# EAGLE design TwoStep (EAGLE 6.2)
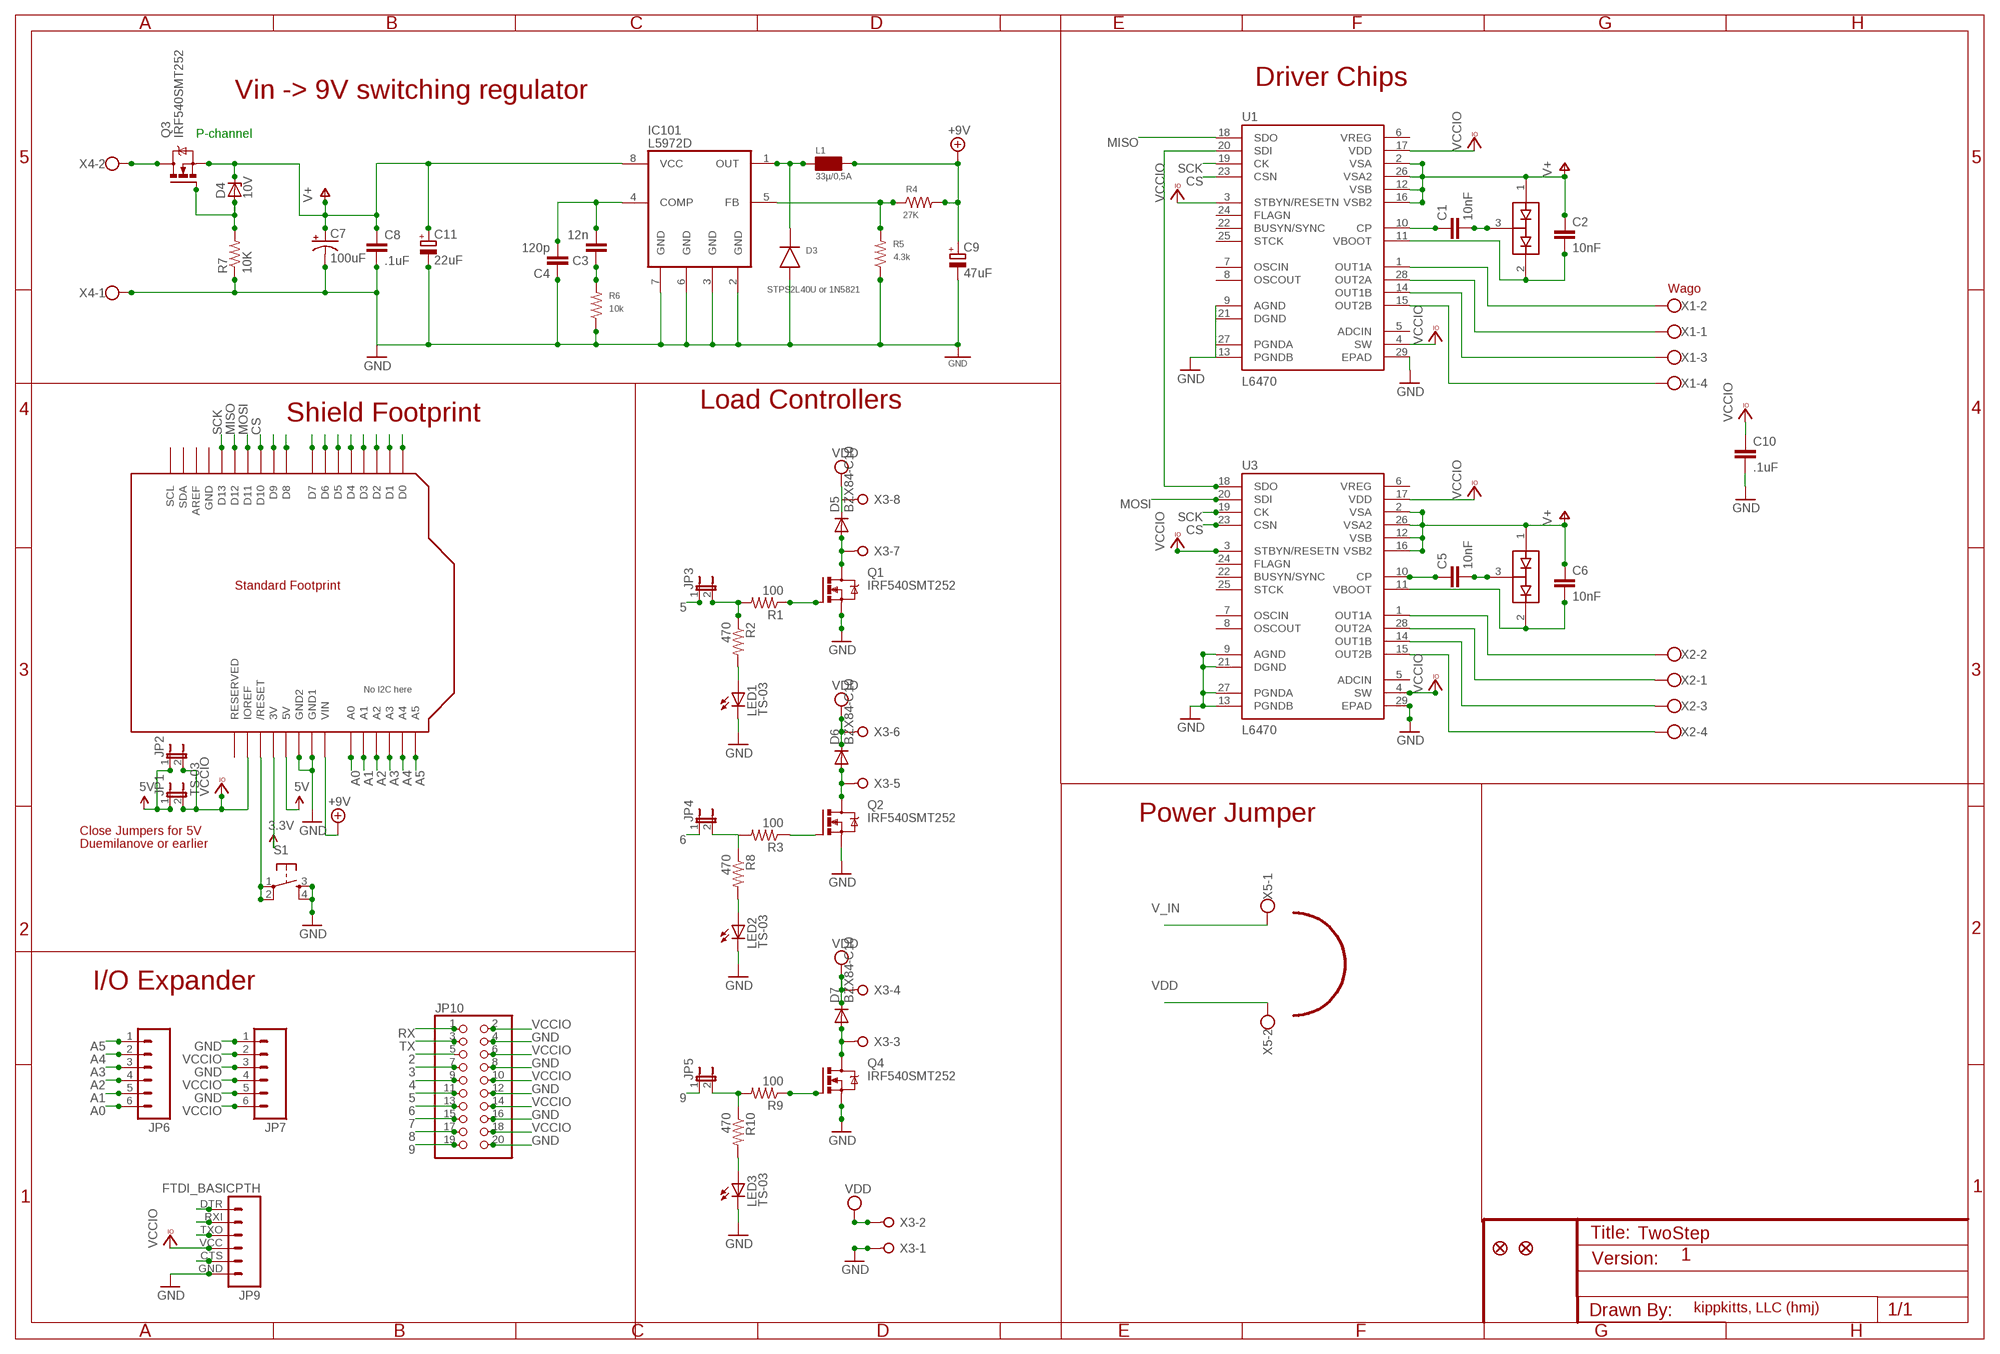
[diagram p0: schematic, sheet 1]

## Parts
C1  10nF  CAP0603-CAP  [0603-CAP]
C2  10nF  CAP0603-CAP  [0603-CAP]
C3  12n  CAP0603-CAP  [0603-CAP]
C4  120p  CAP0603-CAP  [0603-CAP]
C5  10nF  CAP0603-CAP  [0603-CAP]
C6  10nF  CAP0603-CAP  [0603-CAP]
C7  100uF  CAP_POLF80  [NIPPON_F80]
C8  .1uF  CAP0603-CAP  [0603-CAP]
C9  47uF  CPOL-EUC  [PANASONIC_C]
C10  .1uF  CAP0603-CAP  [0603-CAP]
C11  22uF  CPOL-EUC  [PANASONIC_C]
D1  BAV99  MISCELLANY_BAV99  [MISCELLANY_SOT23]
D2  BAV99  MISCELLANY_BAV99  [MISCELLANY_SOT23]
D3  STPS2L40U or 1N5821  DIODE-SMB  [DO-214AA(SMB)]
D4  10V  ZENER-DIODESOT23  [SOT23]
D5  BZX84-C10  DIODESMA-ALT  [SMA-DIODE_ALT]
D6  BZX84-C10  DIODESMA-ALT  [SMA-DIODE_ALT]
D7  BZX84-C10  DIODESMA-ALT  [SMA-DIODE_ALT]
IC101  L5972D  [SO-8]
JP1  TS-03  JUMPER-2PTH  [1X02]
JP2  JUMPER-2SMD-NO  [SJ_2S-NO]
JP3  JUMPER-2SMD-NC  [SJ_2S]
JP4  JUMPER-2SMD-NC  [SJ_2S]
JP5  JUMPER-2SMD-NC  [SJ_2S]
JP6  M06SIP  [1X06]
JP7  M06SIP  [1X06]
JP8  FIDUCIAL1X2  [FIDUCIAL-1X2]
JP9  FTDI_BASICPTH  [FTDI_BASIC]
JP10  PINHD-2X10HAND  [2X10HAND]
JP11  FIDUCIAL1X2  [FIDUCIAL-1X2]
L1  33µ/0,5A  DROSSEL-S  [WE-PD-S]
LED1  TS-03  LEDCHIP-LED0603  [CHIP-LED0603]
LED2  TS-03  LEDCHIP-LED0603  [CHIP-LED0603]
LED3  TS-03  LEDCHIP-LED0603  [CHIP-LED0603]
Q1  IRF540SMT252  [D-PAK_TO252AA]
Q2  IRF540SMT252  [D-PAK_TO252AA]
Q3  IRF540SMT252  [D-PAK_TO252AA]
Q4  IRF540SMT252  [D-PAK_TO252AA]
R1  100  RESISTOR0603-RES  [0603-RES]
R2  470  RESISTOR0603-RES  [0603-RES]
R3  100  RESISTOR0603-RES  [0603-RES]
R4  27K  RESISTOR0603-RES  [0603-RES]
R5  4.3k  RESISTOR0603-RES  [0603-RES]
R6  10k  RESISTOR0603-RES  [0603-RES]
R7  10K  RESISTOR0603-RES  [0603-RES]
R8  470  RESISTOR0603-RES  [0603-RES]
R9  100  RESISTOR0603-RES  [0603-RES]
R10  470  RESISTOR0603-RES  [0603-RES]
S1  TAC_SWITCHSMD  [TACTILE_SWITCH_SMD]
U1  L6470  MISCELLANY_L6470  [MISCELLANY_HTSSOP28]
U2  ARDUINOR3-BPLACE  [ARDUINOR3-BPLACE]
U3  L6470  MISCELLANY_L6470  [MISCELLANY_HTSSOP28]
X1  W237-4  [W237-4]
X2  W237-4  [W237-4]
X3  W237-08P  [W237-8P]
X4  W237-102  [W237-102]
X5  W237-102  [W237-102]

## Nets
1_OUT1A: U1.1(OUT1A) X1.2
1_OUT1B: U1.14(OUT1B) X1.3
1_OUT2A: U1.28(OUT2A) X1.1
1_OUT2B: U1.15(OUT2B) X1.4
2: JP10.5 U2.D2
2_OUT1A: U3.1(OUT1A) X2.2
2_OUT1B: U3.14(OUT1B) X2.3
2_OUT2A: U3.28(OUT2A) X2.1
2_OUT2B: U3.15(OUT2B) X2.4
3: JP10.7 U2.D3
3.3V: U2.3V
4: JP10.9 U2.D4
5: JP3.1 JP10.11 U2.D5
5V: JP1.1 JP2.1 U2.5V
6: JP4.1 JP10.13 U2.D6
7: JP10.15 U2.D7
8: JP10.17 U2.D8
9: JP5.1 JP10.19 U2.D9
+9V: C9.+ L1.2 R4.2 U2.VIN
A0: JP6.6 U2.A0
A1: JP6.5 U2.A1
A2: JP6.4 U2.A2
A3: JP6.3 U2.A3
A4: JP6.2 U2.A4
A5: JP6.1 U2.A5
CS: U1.23(CSN) U2.D10 U3.23(CSN)
CTS: JP9.CTS
DTR: JP9.DTR
GND: C4.1 C7.- C8.2 C9.- C10.2 C11.- D3.A IC101.2(GND) IC101.3(GND) IC101.6(GND) IC101.7(GND) JP7.1 JP7.3 JP7.5 JP9.GND JP10.4 JP10.8 JP10.12 JP10.16 JP10.20 LED1.C LED2.C LED3.C Q1.3(S) Q2.3(S) Q4.3(S) R5.1 R6.1 R7.1 S1.3 S1.4 U1.9(AGND) U1.13(PGNDB) U1.21(DGND) U1.27(PGNDA) U1.29(EPAD) U2.GND1 U2.GND2 U3.9(AGND) U3.13(PGNDB) U3.21(DGND) U3.27(PGNDA) U3.29(EPAD) X3.1 X4.1
MISO: U1.18(SDO) U2.D12
MOSI: U2.D11 U3.20(SDI)
N$1: Q1.1(G) R1.1
N$3: JP3.2 R1.2 R2.1
N$4: Q2.1(G) R3.1
N$5: LED1.A R2.2
N$6: D4.1(A) Q3.1(G) R7.2
N$7: LED2.A R8.2
N$9: C1.1 U1.10(CP)
N$10: C1.2 D1.3(COM)
N$11: C2.2 D1.2(C2) U1.11(VBOOT)
N$12: U1.20(SDI) U3.18(SDO)
N$13: JP4.2 R3.2 R8.1
N$14: Q4.1(G) R9.1
N$15: LED3.A R10.2
N$16: C5.1 U3.10(CP)
N$17: C5.2 D2.3(COM)
N$18: C6.2 D2.2(C2) U3.11(VBOOT)
N$20: JP5.2 R9.2 R10.1
N$21: D5.A Q1.4(D) X3.7
N$23: S1.1 S1.2 U2.RESET(/RESET)
N$25: D6.A Q2.4(D) X3.5
N$27: D7.A Q4.4(D) X3.3
N$50: D3.C(K) IC101.1(OUT) L1.1
N$51: IC101.5(FB) R4.1 R5.2
N$55: C3.2 C4.2 IC101.4(COMP)
N$60: C3.1 R6.2
RX: JP9.RXI JP10.1 U2.D0
SCK: U1.19(CK) U2.D13 U3.19(CK)
TX: JP9.TXO JP10.3 U2.D1
V+: C2.1 C6.1 C7.+ C8.1 C11.+ D1.1(A1) D2.1(A1) D4.3(C) IC101.8(VCC) Q3.3(S) U1.2(VSA) U1.12(VSB) U1.16(VSB2) U1.26(VSA2) U3.2(VSA) U3.12(VSB) U3.16(VSB2) U3.26(VSA2)
V_IN: Q3.4(D) X4.2 X5.1
VCCIO: C10.1 JP1.2 JP2.2 JP7.2 JP7.4 JP7.6 JP9.VCC JP10.2 JP10.6 JP10.10 JP10.14 JP10.18 U1.3(STBYN/RESETN) U1.4(SW) U1.17(VDD) U2.IOREF U3.3(STBYN/RESETN) U3.4(SW) U3.17(VDD)
VDD: D5.C D6.C D7.C X3.2 X3.4 X3.6 X3.8 X5.2
Unconnected: U1.5(ADCIN) U1.6(VREG) U1.7(OSCIN) U1.8(OSCOUT) U1.22(BUSYN/SYNC) U1.24(FLAGN) U1.25(STCK) U2.AREF U2.RESERVED U2.SCL U2.SDA U3.5(ADCIN) U3.6(VREG) U3.7(OSCIN) U3.8(OSCOUT) U3.22(BUSYN/SYNC) U3.24(FLAGN) U3.25(STCK)

## Notes on the sheet
- Driver Chips
- Vin -> 9V switching regulator
- P-channel
- Wago
- Load Controllers
- Shield Footprint
- Power Jumper
- Close Jumpers for 5V
- Duemilanove or earlier
- I/O Expander
- 1
- kippkitts, LLC (hmj)

## Power pins joined to a net without a drawn wire
GND: U2.GND

## Library data of the parts
C1-C6 C8 C10 = KippKitts:CAP: Capacitor Standard 0603 ceramic capacitor, and 0.1" leaded capacitor.
C7 = KippKitts:CAP_POL: Capacitor Polarized These are standard SMD and PTH capacitors. Normally 10uF, 47uF, and 100uF in electrolytic and tantalum varieties. Always verify the external diameter of the through hole cap, it varies with capacity, voltage, and manufacturer. The EIA devices should be standard.
C9 C11 = rcl:CPOL-EU: POLARIZED CAPACITOR, European symbol
D1 D2 = KippKitts:MISCELLANY_BAV99: BAV99 Two small signal silicon diodes connected anode to cathode. Connections to all three nodes available.
D3 = Arm9-Discrete:DIODE
D4 = diode:ZENER-DIODE: Z-Diode
D5-D7 = SparkFun:DIODE: Diode These are standard reverse protection diodes and small signal diodes. SMA package can handle up to about 1A. SOD-323 can handle about 200mA. What the SOD-323 package when ordering, there are some mfgs out there that are 5-pin packages.
IC101 = ARM9-IC:L5972: 2 A Switch Step Down Regulator
JP1-JP5 = SparkFun:JUMPER-2: Jumper Basic 0.1" spaced jumper. Use with breakaway headers.
JP6 JP7 = SparkFun:M06: Header 6 Standard 6-pin 0.1" header. Use with straight break away headers (SKU : PRT-00116), right angle break away headers (PRT-00553), swiss pins (PRT-00743), machine pins (PRT-00117), and female headers (PRT-00115). Molex polarized connector foot print use with SKU : PRT-08094 with associated crimp pins and housings. NOTES ON THE VARIANTS LOCK and LOCK_LONGPADS... This footprint was designed to help hold the alignment of a through-hole component (i.e. 6-pin header) while soldering it into place. You may notice that each hole has been shifted either up or down by 0.005 of an inch from it's more standard position (which is a perfectly straight line). This slight alteration caused the pins (the squares in the middle) to touch the edges of the holes. Because they are alternating, it causes a "brace" to hold the component in place. 0.005 has proven to be the perfect amount of "off-center" position when using our standard breakaway headers. Although looks a little odd when you look at the bare footprint, once you have a header in there, the alteration is very hard to notice. Also, if you push a header all the way into place, it is covered up entirely on the bottom side. This idea of altering the position of holes to aid alignment will be further integrated into the Sparkfun Library for other footprints. It can help hold any component with 3 or more connection pins.
JP8 JP11 = SparkFun:FIDUCIAL: Fiducial Alignment Points Various fiducial points for machine vision alignment.
JP9 = SparkFun:FTDI_BASIC: FTDI Basic: 3.3V and 5V
JP10 = KippKitts:PINHD-2X10: PIN HEADER
L1 = Arm9-Discrete:DROSSEL
LED1-LED3 = Tabber:LED: LED OSRAM: - CHIPLED LG R971, LG N971, LY N971, LG Q971, LY Q971, LO R971, LY R971 LH N974, LH R974 LS Q976, LO Q976, LY Q976 LO Q996 - Hyper CHIPLED LW Q18S LB Q993, LB Q99A, LB R99A - SideLED LS A670, LO A670, LY A670, LG A670, LP A670 LB A673, LV A673, LT A673, LW A673 LH A674 LY A675 LS A676, LA A676, LO A676, LY A676, LW A676 LS A679, LY A679, LG A679 - Hyper Micro SIDELED® LS Y876, LA Y876, LO Y876, LY Y876 LT Y87S - SmartLED LW L88C, LW L88S LB L89C, LB L89S, LG L890 LS L89K, LO L89K, LY L89K LS L896, LA L896, LO L896, LY L896 - TOPLED LS T670, LO T670, LY T670, LG T670, LP T670 LSG T670, LSP T670, LSY T670, LOP T670, LYG T670 LG T671, LOG T671, LSG T671 LB T673, LV T673, LT T673, LW T673 LH T674 LS T676, LA T676, LO T676, LY T676, LB T676, LH T676, LSB T676, LW T676 LB T67C, LV T67C, LT T67C, LS T67K, LO T67K, LY T67K, LW E67C LS E67B, LA E67B, LO E67B, LY E67B, LB E67C, LV E67C, LT E67C LW T67C LS T679, LY T679, LG T679 LS T770, LO T770, LY T770, LG T770, LP T770 LB T773, LV T773, LT T773, LW T773 LH T774 LS E675, LA E675, LY E675, LS T675 LS T776, LA T776, LO T776, LY T776, LB T776 LHGB T686 LT T68C, LB T68C - Hyper Mini TOPLED® LB M676 - Mini TOPLED Santana® LG M470 LS M47K, LO M47K, LY M47K Source: http://www.osram.convergy.de LUXEON: - LUMILED® LXK2-PW12-R00, LXK2-PW12-S00, LXK2-PW14-U00, LXK2-PW14-V00 LXK2-PM12-R00, LXK2-PM12-S00, LXK2-PM14-U00 LXK2-PE12-Q00, LXK2-PE12-R00, LXK2-PE12-S00, LXK2-PE14-T00, LXK2-PE14-U00 LXK2-PB12-K00, LXK2-PB12-L00, LXK2-PB12-M00, LXK2-PB14-N00, LXK2-PB14-P00, LXK2-PB14-Q00 LXK2-PR12-L00, LXK2-PR12-M00, LXK2-PR14-Q00, LXK2-PR14-R00 LXK2-PD12-Q00, LXK2-PD12-R00, LXK2-PD12-S00 LXK2-PH12-R00, LXK2-PH12-S00 LXK2-PL12-P00, LXK2-PL12-Q00, LXK2-PL12-R00 Source: www.luxeon.com KINGBRIGHT: KA-3528ASYC Source: www.kingbright.com
Q1-Q4 = KippKitts:IRF540: HEXFET Power MOSFET N-channel mosfet. LFPACK includes support for many devices, see http://www.nxp.com/documents/leaflet/75016838.pdf
R1-R10 = KippKitts:RESISTOR: Resistor Basic schematic elements and footprints for 0603, 1206, and PTH 1/10th watt (small) resistors.
S1 = SparkFun:TAC_SWITCH: Momentary Switch Button commonly used for reset or general input. Spark Fun Electronics SKU : COM-00097
U1 U3 = KippKitts:MISCELLANY_L6470: L6470 3A RMS/7A peak bipolar stepper motor driver with SPI control and step input in HTSSOP-28 package.
U2 = KippKitts:ARDUINOR3: This is a new object for the new Arduino R3 - with extra pins that you may want to use (such as IOref, and duplicated A4/A5
X1 X2 = con-wago-500:W237-4: WAGO SCREW CLAMP; OC_FARNELL: unknown; OC_NEWARK: unknown
X3 = con-wago-508:W237-08P: WAGO SREW CLAMP; OC_FARNELL: unknown; OC_NEWARK: unknown
X4 X5 = con-wago-500:W237-102: WAGO SCREW CLAMP; MPN: 237-102; OC_FARNELL: unknown; OC_NEWARK: 70K9898

## Board
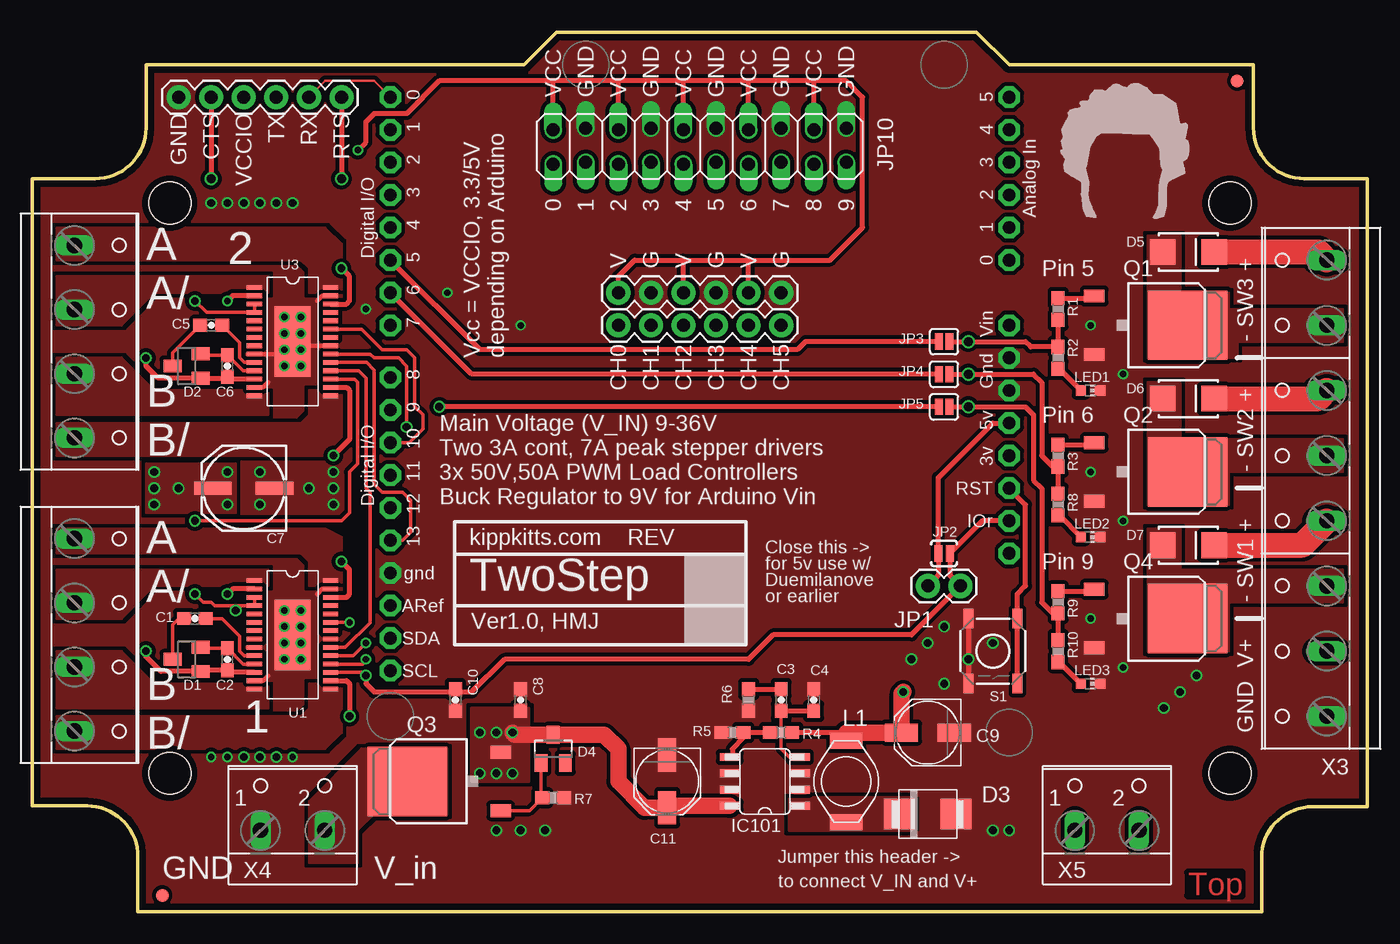
[diagram p1: board, top side]
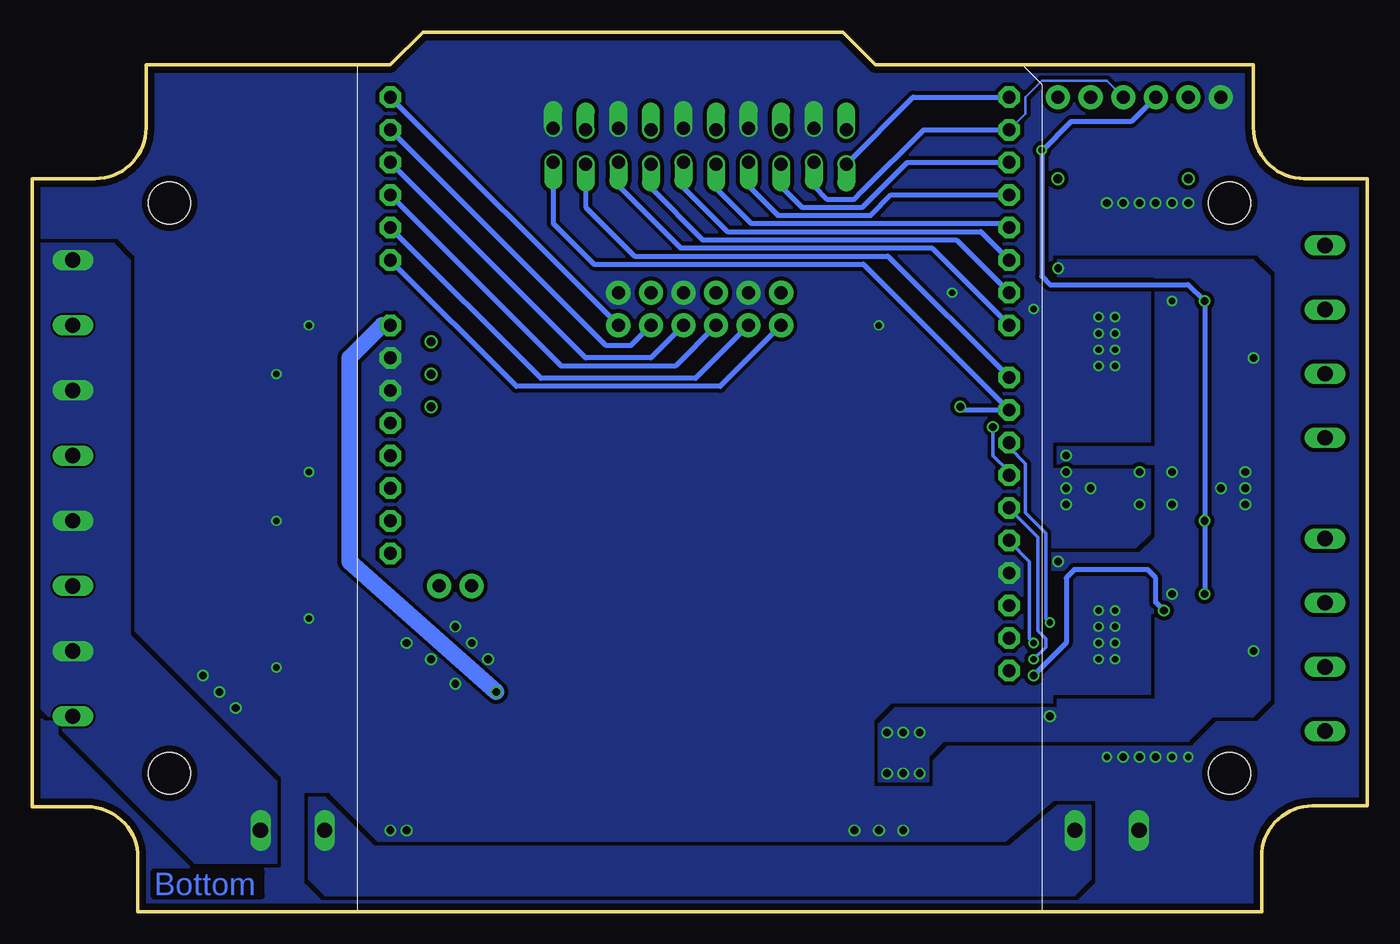
[diagram p2: board, bottom side, seen from below]

Size 104.14 x 68.58 mm. Coordinates in mm from the lower left corner, seen from the top.
Outline: 38.35,66.04 40.89,68.58 73.66,68.58 76.2,66.04 95.25,66.04 95.25,61.11 arc90 99.21,57.15 104.14,57.15 104.14,8.19 99.85,8.19 arc90 95.89,4.22 95.89,0 8.26,0 8.26,4.29 arc90 4.29,8.26 0,8.26 0,57.15 4.93,57.15 arc90 8.89,61.11 8.89,66.04 38.35,66.04
Copper layers (1*16): Top 0.035mm / dielectric 1.5mm / Bottom 0.035mm
Design rules: minimum track width 6mil, minimum drill 12mil, track to track 6mil, track to pad 6mil, pad to pad 6mil, via to via 6mil, smd to smd 6mil, copper to edge 20mil, drill to drill 8mil, minimum pad ring 8mil, minimum via ring 6mil, stop-mask expansion 3mil, vias tented up to drill 0mil, thermal gap 8mil
Holes 3.28 mm at 10.74,55.24 93.42,55.24 93.42,10.79 10.74,10.79

### Footprints (pad centres in the part's own frame; a part is rotated, then mirrored left to right if it is on the bottom)
0603-CAP = smd 1.1 x 1: 1 -0.85,0; 2 0.85,0
NIPPON_F80 = smd 2.95 x 1: + 2.4,0; - -2.4,0
PANASONIC_C = smd 2.6 x 1.4: + 2.05,0; - -2.05,0
MISCELLANY_SOT23 = smd 1 x 1.4: 1 -0.95,-1.1; 2 0.95,-1.1; 3 0,1.1
DO-214AA(SMB) = smd 2.4 x 2.4: A 2.2,0; C -2.2,0
SOT23 = smd 1 x 1.4: 1 -0.95,-1.1; 2 0.95,-1.1; 3 0,1.1
SMA-DIODE_ALT = smd 2 x 2: A -2,0; C 2,0
SO-8 = smd 0.61 x 1.524: 1 -1.905,-2.743; 2 -0.635,-2.743; 3 0.635,-2.743; 4 1.905,-2.743; 5 1.905,2.743; 6 0.635,2.743; 7 -0.635,2.743; 8 -1.905,2.743
1X02 = drill 1.016 pad 1.88: 1 0,0; 2 2.54,0
SJ_2S-NO = smd 0.635 x 1.27: 1 -0.45,0; 2 0.45,0
SJ_2S = smd 0.635 x 1.27: 1 -0.412,0; 2 0.412,0
1X06 = drill 1.016 pad 1.88: 1 0,0; 2 2.54,0; 3 5.08,0; 4 7.62,0; 5 10.16,0; 6 12.7,0
FIDUCIAL-1X2 = smd 1 x 1: 1 0,0
FTDI_BASIC = drill 1.016 pad 1.88: CTS 10.16,0; DTR 0,0; GND 12.7,0; RXI 2.54,0; TXO 5.08,0; VCC 7.62,0
2X10HAND = drill 1.016 offset: 1 -11.43,-1.397; 2 -11.43,1.27; 3 -8.89,-1.27; 4 -8.89,1.397; 5 -6.35,-1.397; 6 -6.35,1.27; 7 -3.81,-1.27; 8 -3.81,1.397; 9 -1.27,-1.397; 10 -1.27,1.27; 11 1.27,-1.27; 12 1.27,1.397; 13 3.81,-1.397; 14 3.81,1.27; 15 6.35,-1.27; 16 6.35,1.397; 17 8.89,-1.397; 18 8.89,1.27; 19 11.43,-1.27; 20 11.43,1.397
WE-PD-S = smd 2.54 x 1.27: 1 0,-3.175; 2 0,3.175
CHIP-LED0603 = smd 0.8 x 0.8: A 0,-0.75; C 0,0.75
D-PAK_TO252AA = smd 1 x 1.6: 1 -2.28,-4.8; 3 2.28,-4.8 | smd 5.4 x 6.2: 4 0,2.5
0603-RES = smd 1.1 x 1: 1 -0.85,0; 2 0.85,0
TACTILE_SWITCH_SMD = smd 1.524 x 0.762: 1 -2.54,1.905; 2 2.54,1.905; 3 -2.54,-1.905; 4 2.54,-1.905
MISCELLANY_HTSSOP28 = smd 0.36 x 1.19: 1 -4.225,-2.97; 2 -3.575,-2.97; 3 -2.925,-2.97; 4 -2.275,-2.97; 5 -1.625,-2.97; 6 -0.975,-2.97; 7 -0.325,-2.97; 8 0.325,-2.97; 9 0.975,-2.97; 10 1.625,-2.97; 11 2.275,-2.97; 12 2.925,-2.97; 13 3.575,-2.97; 14 4.225,-2.97; 15 4.225,2.97; 16 3.575,2.97; 17 2.925,2.97; 18 2.275,2.97; 19 1.625,2.97; 20 0.975,2.97; 21 0.325,2.97; 22 -0.325,2.97; 23 -0.975,2.97; 24 -1.625,2.97; 25 -2.275,2.97; 26 -2.925,2.97; 27 -3.575,2.97; 28 -4.225,2.97 | smd 5.5 x 2.8: 29 0,0
ARDUINOR3-BPLACE = drill 1 pad 1.676 octagon: 3V 35.56,2.54; 5V 38.1,2.54; A0 50.8,2.54; A1 53.34,2.54; A2 55.88,2.54; A3 58.42,2.54; A4 60.96,2.54; A5 63.5,2.54; AREF 23.876,50.8; D0 63.5,50.8; D1 60.96,50.8; D2 58.42,50.8; D3 55.88,50.8; D4 53.34,50.8; D5 50.8,50.8; D6 48.26,50.8; D7 45.72,50.8; D8 41.656,50.8; D9 39.116,50.8; D10 36.576,50.8; D11 34.036,50.8; D12 31.496,50.8; D13 28.956,50.8; GND 26.416,50.8; GND1 43.18,2.54; GND2 40.64,2.54; IOREF 30.48,2.54; RESERVED 27.94,2.54; RESET 33.02,2.54; SCL 18.796,50.8; SDA 21.336,50.8; VIN 45.72,2.54
W237-4 = drill 1.194 long: 1 -7.5,-1.27; 2 -2.5,-1.27; 3 2.5,-1.27; 4 7.5,-1.27
W237-8P = drill 1.194 long: 1 -17.78,-0.635; 2 -12.7,-0.635; 3 -7.62,-0.635; 4 -2.54,-0.635; 5 2.54,-0.635; 6 7.62,-0.635; 7 12.7,-0.635; 8 17.78,-0.635
W237-102 = drill 1.194 long: 1 -2.5,-1.27; 2 2.5,-1.27

### Placement (x,y rotation side)
C1  12.7,22.86 180 top
C2  15.24,19.68 90 top
C3  58.42,16.51 270 top
C4  60.96,16.51 270 top
C5  13.97,45.72 180 top
C6  15.24,42.55 90 top
C7  16.51,33.02 180 top
C8  38.1,16.51 90 top
C9  69.85,13.97 180 top
C10  33.02,16.51 270 top
C11  49.53,10.16 270 top
D1  12.06,19.68 90 top
D2  12.06,42.55 90 top
D3  69.85,7.62 0 top
D4  40.64,12.7 0 top
D5  90.17,51.44 0 top
D6  90.17,40.01 0 top
D7  90.17,28.57 0 top
IC101  57.15,10.16 90 top
JP1  69.85,25.4 0 top
JP2  71.12,27.94 0 top
JP3  71.12,44.45 0 top
JP4  71.12,41.91 0 top
JP5  71.12,39.37 0 top
JP6  58.42,45.72 180 top
JP7  58.42,48.26 180 top
JP8  10.16,1.27 0 top
JP9  24.13,63.5 180 top
JP10  52.07,59.69 0 top
JP11  93.98,64.77 0 top
KK_LOGO  [TOP_DOCU_10MM]  80.01,53.98 0 top
L1  63.5,10.16 0 top
LED1  82.55,40.64 270 top
LED2  82.55,29.21 270 top
LED3  82.55,17.78 270 top
Q1  87.63,45.72 270 top
Q2  87.63,34.29 270 top
Q3  31.75,10.16 90 top
Q4  87.63,22.86 270 top
R1  80.01,46.99 270 top
R2  80.01,43.18 270 top
R3  80.01,35.56 270 top
R4  58.42,13.97 0 top
R5  54.61,13.97 0 top
R6  55.88,16.51 90 top
R7  40.64,8.89 180 top
R8  80.01,31.75 270 top
R9  80.01,24.13 270 top
R10  80.01,20.32 270 top
S1  74.93,20.32 270 top
U1  20.32,21.59 270 top
U2  78.74,0 90 top
U3  20.32,44.45 270 top
X1  4.57,21.59 270 top
X2  4.57,44.45 270 top
X3  100.33,33.02 90 top
X4  20.32,7.62 0 top
X5  83.82,7.62 0 top

### Tracks (layer width: path | path; a pad name or v marks a point on that pad's centre or on a via)
1_OUT1A
  pour Top (isolate 0.305, no thermals): 1.91,26.67 1.91,22.86 6.99,22.86 9.53,25.4 18.41,25.4 18.41,26.67
1_OUT1B
  pour Top (isolate 0.305, no thermals): 18.41,17.78 9.53,17.78 6.99,20.32 1.91,20.32 1.91,15.88 18.41,15.88
1_OUT2A
  pour Top (isolate 0.305, no thermals): 21.59,25.4 24.13,25.4 24.13,29.21 22.86,29.84 1.91,29.84 1.91,27.94 20.95,27.94 21.59,27.3
1_OUT2B
  pour Top (isolate 0.305, no thermals): 21.59,17.78 24.13,17.78 24.13,13.97 22.86,12.7 1.91,12.7 1.91,15.24 20.95,15.24 21.59,15.88
2
  Bottom 0.406: JP10.5 45.72,56.55 44.1,54.93 39.37,54.93 38.1,56.2 35.88,58.42 U2.D2
2_OUT1A
  pour Top (isolate 0.305, no thermals): 1.91,49.53 1.91,45.72 6.99,45.72 9.53,48.26 18.41,48.26 18.41,49.53
2_OUT1B
  pour Top (isolate 0.305, no thermals): 18.41,40.64 9.53,40.64 6.99,43.18 1.91,43.18 1.91,38.73 18.41,38.73
2_OUT2A
  pour Top (isolate 0.305, no thermals): 21.59,48.26 24.13,48.26 24.13,52.07 22.86,53.34 1.91,53.34 1.91,50.8 20.95,50.8 21.59,50.16
2_OUT2B
  pour Top (isolate 0.305, no thermals): 21.59,40.64 24.13,40.64 24.13,36.83 22.86,35.56 1.91,35.56 1.91,38.1 20.95,38.1 21.59,38.73
3
  Bottom 0.406: JP10.7 48.26,56.58 45.97,54.29 38.73,54.29 37.15,55.88 U2.D3
4
  Bottom 0.406: JP10.9 50.8,56.39 48.07,53.66 28.26,53.66 U2.D4
5
  Top 0.406: U2.D5 34.92,43.81 59.69,43.81 60.33,44.45 JP3.1
  Bottom 0.406: JP10.11 53.34,56.46 49.91,53.02 30.16,53.02 U2.D5
5V
  Top 0.406: JP1.1 70.67,26.22 JP2.1 70.67,33.84 74.93,38.1 U2.5V
6
  Top 0.406: U2.D6 33.66,42.55 34.29,41.91 JP4.1
  Bottom 0.406: JP10.13 55.88,56.43 51.84,52.39 32.07,52.39 U2.D6
7
  Bottom 0.406: JP10.15 58.42,56.6 53.57,51.75 33.97,51.75 U2.D7
8
  Bottom 0.406: JP10.17 60.96,54.93 57.15,51.12 37.4,51.12 U2.D8
9  (via drill 0.6)
  Top 0.406: JP5.1 v31.75,39.37
  Bottom 0.406: JP10.19 63.5,53.66 60.33,50.48 39.31,50.48 U2.D9 31.5,39.12 v31.75,39.37
+9V  (via drill 0.6)
  Top 0.406: 63.5,13.97 R4.2 59.05,13.97
  Top 1.27: L1.2 63.5,13.97 C9.+ 67.8,17 v67.94,17.14
  Bottom 1.27: v67.94,17.14 79.38,27.3 79.38,43.18 76.83,45.72 U2.VIN
A0
  Bottom 0.406: JP6.6 50.48,40.96 66.36,40.96 U2.A0
A1
  Bottom 0.406: JP6.5 52.39,41.59 64.45,41.59 U2.A1
A2
  Bottom 0.406: JP6.4 53.98,42.55 62.87,42.55 U2.A2
A3
  Bottom 0.406: JP6.3 55.88,43.18 60.96,43.18 U2.A3
A4
  Bottom 0.406: JP6.2 57.47,44.13 59.37,44.13 U2.A4
A5
  Bottom 0.406: JP6.1 U2.A5
CS  (via drill 0.5)
  Top 0.254: U1.23 24.74,22.57 v24.77,22.54 | U3.23 25.7,45.42 27.3,43.81 29.21,43.81 29.84,43.18 29.84,39.37 30.48,38.73 30.48,37.67 29.39,36.58 U2.D10
  Bottom 0.254: v24.77,22.54 25.08,22.86 25.08,29.53 26.67,31.11 26.67,34.92 27.94,36.2 U2.D10
CTS  (via drill 0.7)
  Top 0.406: JP9.CTS v13.97,57.15
DTR  (via drill 0.7)
  Top 0.406: JP9.DTR v24.13,57.15
GND  (via drill 0.5, 0.6)
  Top 0.356: U3.9 19.34,43.48 v19.68,43.81 U3.29 | U3.21 21.27,44.12 v20.95,43.81 | U3.13 18.02,40.88 18.41,41.27 | U3.27 22.62,48.02 22.23,47.62 | v19.68,20.95 U1.29 | U1.27 22.62,25.16 22.23,24.77 | U1.13 18.02,18.02 18.41,18.41
  Top 0.406: S1.3 v73.03,19.68 S1.4
  other vias: 19.68,23.5 20.95,23.5 19.68,22.23 20.95,22.23 20.95,20.95 19.68,19.68 20.95,19.68 19.68,46.35 20.95,46.35 19.68,45.09 20.95,45.09 19.68,42.55 20.95,42.55 17.78,34.29 21.59,33.02 17.78,31.75 23.5,34.29 23.5,33.02 23.5,31.75 13.97,55.24 15.24,55.24 16.51,55.24 17.78,55.24 19.05,55.24 20.32,55.24 16.51,12.06 17.78,12.06 19.05,12.06 13.97,12.06 15.24,12.06 20.32,12.06 82.55,45.72 85.09,41.91 82.55,34.29 85.09,30.48 82.55,22.86 85.09,19.05 38.1,45.72 26.04,46.99 32.38,48.26 88.27,15.88 89.53,17.14 90.81,18.41 71.12,22.23 69.85,20.95 68.58,19.68 74.93,20.95 71.12,17.78 36.2,6.35 38.1,6.35 40.01,6.35 74.93,6.35 76.2,6.35
  pour Top (isolate 0.305, rank 2, no thermals): 0,0 104.14,0 104.14,68.58 0,68.58
  pour Bottom (isolate 0.305, rank 2, no thermals): 0,0 104.14,0 104.14,68.58 0,68.58
MISO  (via drill 0.5)
  Top 0.254: U1.18 25.77,19.32 v26.04,19.68
  Bottom 0.254: U2.D12 27.94,31.43 25.72,29.21 25.72,21.91 25.08,21.27 25.08,20.64 v26.04,19.68
MOSI  (via drill 0.6)
  Top 0.254: U3.20 26.38,43.48 26.67,43.18 28.57,43.18 29.21,42.55 v29.21,37.78
  Bottom 0.254: v29.21,37.78 29.21,35.56 27.94,34.29 U2.D11
N$1
  Top 0.406: 82.55,48.26 82.81,48 Q1.1 82.67,47.84 R1.1
N$3  (via drill 0.7)
  Top 0.406: R1.2 R2.1 77.89,44.03 77.47,44.45 v73.03,44.45 JP3.2
N$4
  Top 0.406: R3.1 82.67,36.41 Q2.1
N$5
  Top 0.406: R2.2 80.11,42.33 LED1.A
N$6
  Top 0.254: D4.1 39.69,8.99 R7.2 38.78,7.88 Q3.1
N$7
  Top 0.406: R8.2 80.11,30.9 LED2.A
N$9
  Top 0.254: U1.10 16.55,19.96 16.19,20.32 16.19,21.49 14.82,22.86 C1.1
N$10
  Top 0.254: D1.3 10.96,22.39 11.43,22.86 C1.2
N$11
  Top 0.254: U1.11 16.46,19.32 C2.2 13.27,20.54 D1.2
N$12
  Top 0.254: U1.20 24.43,20.61 26.35,22.54 26.35,32.7 26.04,33.02 26.04,41.59 25.45,42.17 U3.18
N$13  (via drill 0.7)
  Top 0.406: R8.1 R3.2 79.59,34.71 78.74,35.56 78.74,41.27 78.11,41.91 v73.03,41.91 JP4.2
N$14
  Top 0.406: R9.1 82.67,24.98 Q4.1
N$15
  Top 0.406: R10.2 80.11,19.47 LED3.A
N$16
  Top 0.254: U3.10 16.55,42.83 16.19,43.18 16.19,44.35 C5.1
N$17
  Top 0.254: D2.3 10.96,43.56 C5.2
N$18
  Top 0.254: U3.11 16.46,42.17 C6.2 13.27,43.4 D2.2
N$20  (via drill 0.7)
  Top 0.406: R10.1 R9.2 79.59,23.28 78.74,24.13 78.74,33.02 78.11,33.66 78.11,38.73 77.47,39.37 v73.03,39.37 JP5.2
N$21
  pour Top (isolate 0.305, no thermals): 102.23,44.45 93.98,44.45 93.98,43.18 87,43.18 87,52.7 89.53,52.7 89.53,48.26 93.34,48.26 93.34,46.99 102.23,46.99
N$23
  Top 0.406: S1.2 S1.1 76.83,24.77 77.47,25.4 77.47,31.75 U2.RESET
N$25
  pour Top (isolate 0.305, no thermals): 102.23,34.29 93.34,34.29 93.34,31.75 87,31.75 87,41.27 89.53,41.27 89.53,36.83 102.23,36.83
N$27
  pour Top (isolate 0.305, no thermals): 102.23,26.67 102.23,24.13 93.34,24.13 93.34,20.32 87,20.32 87,29.84 89.53,29.84 89.53,26.67
N$50
  pour Top (isolate 0.305, no thermals): 59.05,6.35 59.05,8.89 68.58,8.89 68.58,6.35
N$51
  Top 0.406: R4.1 R5.2 55.46,13.55 54.61,12.7 54.61,12.27 IC101.5
N$55
  Top 0.254: IC101.4 59.05,12.06 58.42,12.7 C3.2
  Top 0.406: C3.2 C4.2
N$60
  Top 0.406: R6.2 C3.1
RX
  Top 0.203: U2.D0 26.67,64.77 22.86,64.77 JP9.RXI
  Bottom 0.406: JP10.1 35.43,63.5 U2.D0
SCK  (via drill 0.5)
  Top 0.254: U3.19 26.07,42.83 26.67,42.23 26.67,33.34 27.3,32.7 28.89,32.7 29.53,32.07 29.53,29.59 28.89,28.96 U2.D13 | U1.19 25.05,19.96 v26.04,20.95
  Bottom 0.254: v26.04,20.95 26.35,21.27 26.35,27.3 27.94,28.89 U2.D13
TX
  Bottom 0.203: U2.D1 26.67,62.23 26.67,63.5 25.4,64.77 20.32,64.77 JP9.TXO
  Bottom 0.406: JP10.3 43.18,56.57 42.18,55.56 40.01,55.56 39.37,56.2 34.61,60.96 U2.D1
V+  (via drill 0.5, 0.6)
  Top 0.406: U3.2 15.64,48.02 v15.24,47.62 | U1.2 15.64,25.16 v15.24,24.77 | U1.12 15.62,18.66 15.24,19.05 C2.1 13.27,18.84 D1.1 10.03,18.73 8.89,19.88 v8.89,20.32 | v8.89,43.18 8.89,42.55 9.84,41.59 D2.1 15.14,41.59 C6.1 15.41,41.52 U3.12 | U1.26 24.52,24.52 24.77,24.77 24.77,26.67 v24.13,27.3 | U1.16 24.53,18.02 24.77,17.78 v24.77,15.24 | U3.16 24.53,40.88 24.77,40.64 24.77,36.83 v23.5,35.56 | U3.26 24.52,47.38 24.77,47.62 24.77,49.53 v24.13,50.16
  Top 1.27: v37.47,13.97 37.63,13.8 D4.3 44.62,13.8 45.72,12.7 45.72,10.16 47.77,8.11 C11.+ 49.67,8.26 IC101.8
  other vias: 9.53,34.29 9.53,33.02 9.53,31.75 15.24,34.29 11.43,33.02 15.24,31.75 34.92,13.97 36.2,13.97 37.47,10.79 36.2,10.79 34.92,10.79
  pour Bottom (isolate 0.305): 24.13,16.51 16.51,16.51 16.51,26.67 24.77,26.67 24.77,27.94 17.78,27.94 16.51,29.21 16.51,34.92 24.13,34.92 24.13,36.2 16.51,36.2 16.51,49.53 24.13,49.53 24.13,50.8 8.89,50.8 7.62,49.53 7.62,16.51 8.89,15.24 12.06,15.24 13.97,13.34 33.02,13.34 34.29,12.06 34.29,10.16 38.1,10.16 38.1,14.61 36.83,15.88 24.13,15.88
  pour Top (isolate 0.305, no thermals): 9.53,34.92 8.89,34.92 8.89,31.11 15.88,31.11 15.88,34.92
  pour Top (isolate 0.305, no thermals): 34.29,15.88 34.29,10.16 38.73,10.16 38.73,15.88
V_IN
  pour Top (isolate 0.305, no thermals): 32.38,12.7 25.66,12.7 21.59,8.63 21.59,3.81 25.4,3.81 25.4,6.35 26.67,7.62 32.38,7.62
  pour Bottom (isolate 0.305, no thermals): 77.47,5.08 27.94,5.08 24.13,8.26 21.59,8.26 21.59,2.54 22.86,1.27 81.28,1.27 82.55,2.54 82.55,8.89 81.28,8.89
VCCIO  (via drill 0.5, 0.6)
  Top 0.254: U1.4 U1.3 | U3.3 17.39,47.38 17.46,47.31 17.35,47.2 U3.4 13.6,46.73 v12.7,47.62 | U3.17 25.15,41.52 25.4,41.27 25.4,34.92 24.77,34.29 24.77,31.11 24.13,30.48 v12.7,30.48 | U1.17 25.79,18.66 v26.04,18.41 | U1.4 15.88,23.86 | 15.88,23.86 14.23,23.86 13.97,24.13 13.34,24.13 v12.7,24.77 | U1.4 16.25,23.86 | v15.88,23.5 15.88,23.86
  Top 0.406: v26.04,18.41 26.04,17.78 26.67,17.14 32.8,17.14 C10.1 33.02,17.14 34.29,17.14 36.83,19.68 55.88,19.68 57.78,21.59 68.58,21.59 JP1.2 71.57,26.22 JP2.2 74.11,30.48 U2.IOREF | JP7.6 45.72,49.53 46.99,50.8 50.8,50.8 | 50.8,50.8 55.88,50.8 | 55.88,50.8 62.23,50.8 64.77,53.34 64.77,63.5 63.5,64.77 60.96,64.77 | 60.96,64.77 55.88,64.77 | 55.88,64.77 50.8,64.77 | 50.8,64.77 45.72,64.77 | 45.72,64.77 40.64,64.77 | 40.64,64.77 31.75,64.77 29.21,62.23 26.67,62.23 26.04,61.59 26.04,60.01 v25.4,59.37 | JP10.6 45.72,64.77 | JP10.2 40.64,64.77 | JP10.10 50.8,64.77 | JP10.18 60.96,64.77 | JP10.14 55.88,64.77 | JP7.4 50.8,50.8 | JP7.2 55.88,50.8
  Bottom 0.406: v15.88,23.5 16.51,24.13 16.51,26.04 17.14,26.67 22.86,26.67 23.5,26.04 23.5,20.95 v26.04,18.41 | v12.7,24.77 v12.7,30.48 v12.7,47.62 13.97,48.9 24.77,48.9 25.4,49.53 25.4,59.3 | JP9.VCC 18.41,61.59 23.11,61.59 25.4,59.3 | 25.4,59.3 v25.4,59.37
VDD
  Top 1.93: D5.C 100.33,51.44 X3.8 | D6.C 100.33,40.01 X3.6 | D7.C 99.06,28.57 X3.4
  pour Bottom (no thermals): 104.14,52.07 104.14,16.51 91.44,3.81 85.09,3.81 85.09,10.16 96.52,21.59 96.52,50.8 97.79,52.07

### Text on the board
Top: Top
Bottom: Bottom
tPlace: VCC | GND | VCC | GND | VCC | GND | VCC | GND | VCC | GND | GND | CTS | VCCIO | TX | RX | RTS | 0 | 1 | 2 | 3 | 4 | 5 | 6 | 7 | 8 | 9 | A | 2 | V | G | V | G | V | G | Pin 5 | A/ | - SW3 + | Vcc = VCCIO, 3.3/5V | depending on Arduino | CH0 | CH1 | CH2 | CH3 | CH4 | CH5 | B | Pin 6 | Main Voltage (V_IN) 9-36V | B/ | Two 3A cont, 7A peak stepper drivers | 3x 50V,50A PWM Load Controllers | - SW2 + | Buck Regulator to 9V for Arduino Vin | A | Close this -> | for 5v use w/ | Pin 9 | Duemilanove | A/ | or earlier | - SW1 + | V+ | B | 1 | GND | B/ | Jumper this header -> | GND | V_in | to connect V_IN and V+
tNames: kippkitts.com REV | TwoStep | Ver1.0, HMJ
Document: V+ max 50V